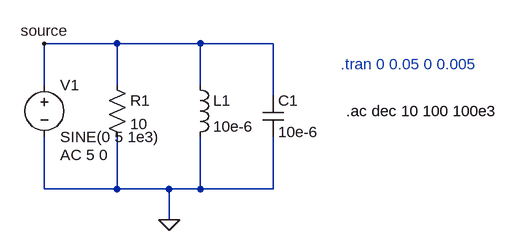
[diagram p0: schematic q2_schematic.asc]
q2_schematic.asc, the LTspice schematic file:
Version 4.1
SHEET 1 1260 680
WIRE 112 32 0 32
WIRE 240 32 112 32
WIRE 352 32 240 32
WIRE 0 96 0 32
WIRE 112 96 112 32
WIRE 240 96 240 32
WIRE 352 112 352 32
WIRE 0 256 0 176
WIRE 112 256 112 176
WIRE 112 256 0 256
WIRE 192 256 112 256
WIRE 240 256 240 176
WIRE 240 256 192 256
WIRE 352 256 352 176
WIRE 352 256 240 256
WIRE 192 304 192 256
FLAG 192 304 0
FLAG 0 32 source
SYMBOL res 96 80 R0
SYMATTR InstName R1
SYMATTR Value 10
SYMBOL ind 224 80 R0
SYMATTR InstName L1
SYMATTR Value 10e-6
SYMATTR SpiceLine Rser=1m
SYMBOL cap 336 112 R0
SYMATTR InstName C1
SYMATTR Value 10e-6
SYMBOL voltage 0 80 R0
WINDOW 123 24 124 Left 2
WINDOW 39 0 0 Left 0
SYMATTR InstName V1
SYMATTR Value SINE(0 5 1e3)
SYMATTR Value2 AC 5 0
TEXT 456 64 Left 2 ;.tran 0 0.05 0 0.005
TEXT 464 136 Left 2 !.ac dec 10 100 100e3

The netlist it stands for:
* q2_schematic.asc
R1 source 0 10
L1 source 0 10e-6 Rser=1m
C1 source 0 10e-6
V1 source 0 SINE(0 5 1e3) AC 5 0
* .tran 0 0.05 0 0.005
.ac dec 10 100 100e3
.backanno
.end